# Altium schematic sheet ControlPlateGOST.SchDoc
size 420 x 297 mm; Address1: Address1; Address2: Address2; Address3: Address3; Address4: Address4; SheetNumber: 2; SheetTotal: 2; Scale: 1:1; Разраб.: Калашников Д.; Обозначение документа: КР17530324КДА10.00.00ЭЗ; Пров.: Яцун А.С.; Наименование организации: ЮЗГУ гр. МТ11-б; Перв. применение: АБВГ.123456.000; Наименование изделия 1: Блок управления; Наименование изделия 2: Схема электрическая; Наименование изделия 3: принципиальная; Нач. отд.: Нач. отд.
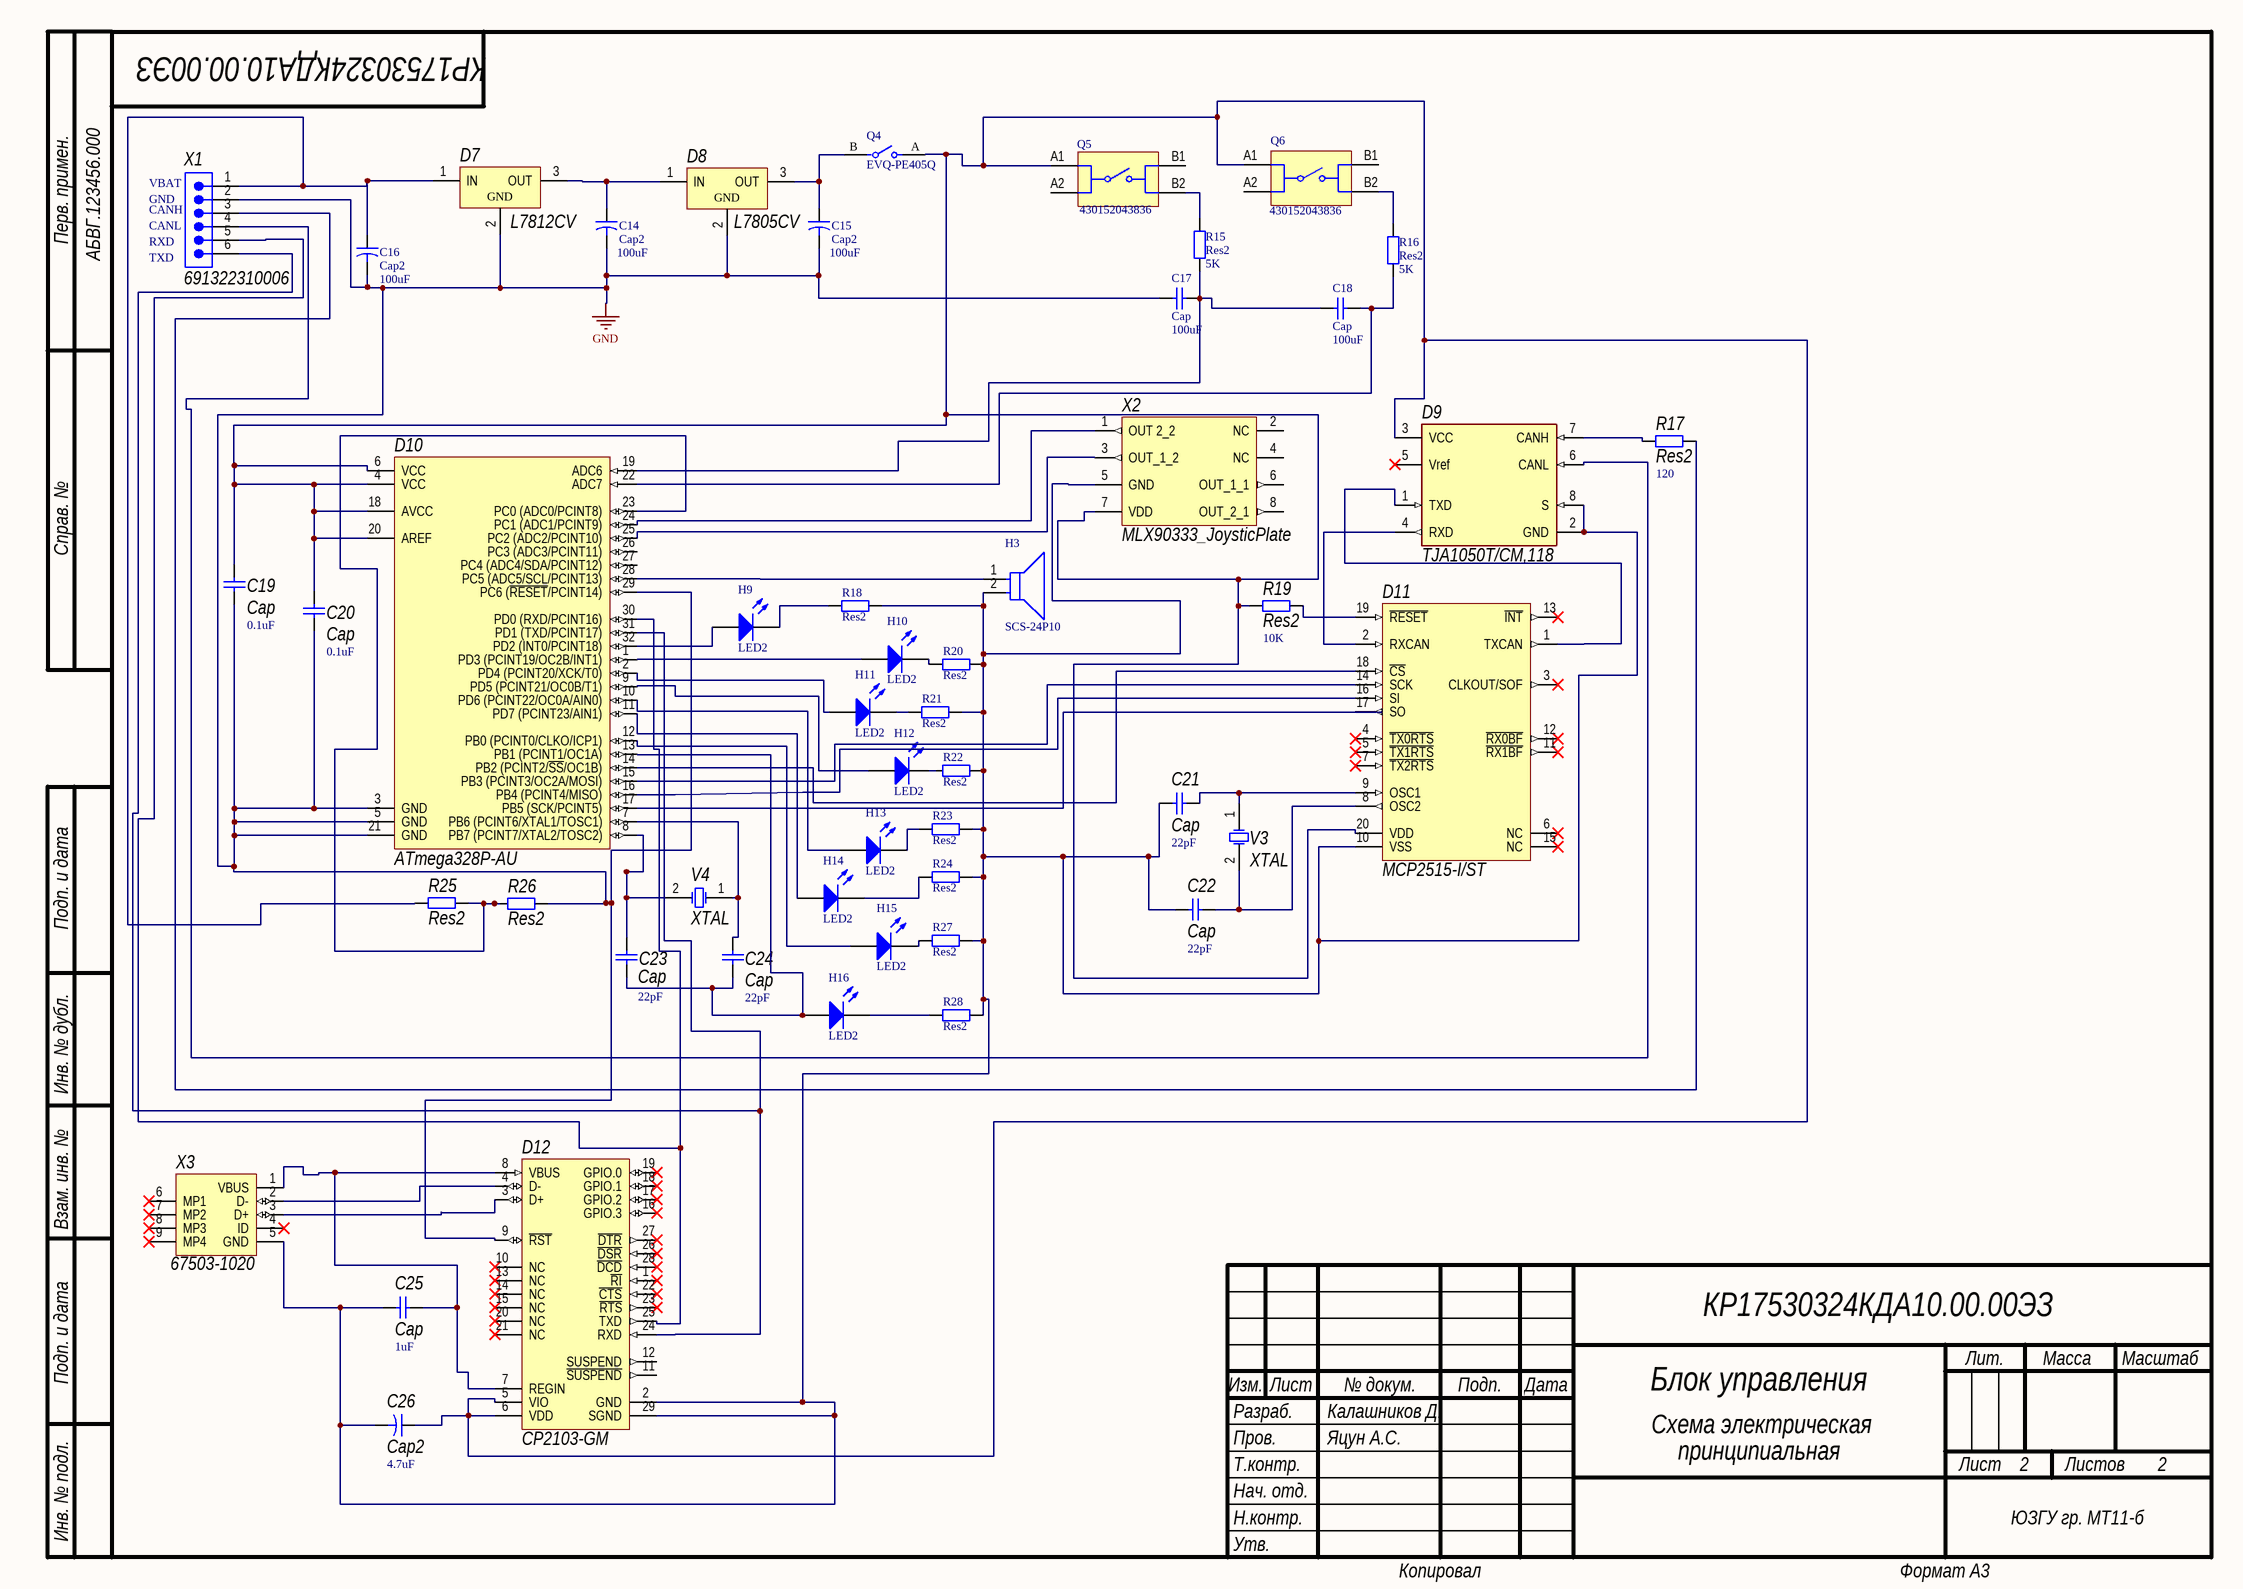
[diagram p0: ControlPlateGOST.SchDoc]

## Parts
C14  Cap2  value 100uF  [CAPR5-4X5]
C15  Cap2  value 100uF  [CAPR5-4X5]
C16  Cap2  value 100uF  [CAPR5-4X5]
C17  Cap  value 100uF  [RAD-0.3]
C18  Cap  value 100uF  [RAD-0.3]
C19  Cap  value 0.1uF  [RAD-0.3]
C20  Cap  value 0.1uF  [RAD-0.3]
C21  Cap  value 22pF  [RAD-0.3]
C22  Cap  value 22pF  [RAD-0.3]
C23  Cap  value 22pF  [RAD-0.3]
C24  Cap  value 22pF  [RAD-0.3]
C25  Cap  value 1uF  [RAD-0.3]
C26  Cap2  value 4.7uF  [CAPR5-4X5]
D7  L7812CV  [TO220]
D8  L7805CV  [TO220]
D9  TJA1050T/CM,118  [FP-SOT96-1-IPC_A]
D10  ATmega328P-AU  [32A_M]
D11  MCP2515-I/ST  [TSSOP-ST20_N]
D12  CP2103-GM  [SLAB-QFN-28-3125x3125TP_A_M]
H3  SCS-24P10  [FP-PKB24SPCH3601-B0-MFG]
H9  LED2  [3.2X1.6X1.1]
H10  LED2  [3.2X1.6X1.1]
H11  LED2  [3.2X1.6X1.1]
H12  LED2  [3.2X1.6X1.1]
H13  LED2  [3.2X1.6X1.1]
H14  LED2  [3.2X1.6X1.1]
H15  LED2  [3.2X1.6X1.1]
H16  LED2  [3.2X1.6X1.1]
Q4  EVQ-PE405Q  [FP-EVQ-PE405Q-MFG]
Q5  430152043836  [WS-TASV_L6W6H4.3_4301x20438x6]
Q6  430152043836  [WS-TASV_L6W6H4.3_4301x20438x6]
R15  Res2  value 5K  [AXIAL-0.4]
R16  Res2  value 5K  [AXIAL-0.4]
R17  Res2  value 120  [AXIAL-0.4]
R18  Res2  [AXIAL-0.4]
R19  Res2  value 10K  [AXIAL-0.4]
R20  Res2  [AXIAL-0.4]
R21  Res2  [AXIAL-0.4]
R22  Res2  [AXIAL-0.4]
R23  Res2  [AXIAL-0.4]
R24  Res2  [AXIAL-0.4]
R25  Res2  [AXIAL-0.4]
R26  Res2  [AXIAL-0.4]
R27  Res2  [AXIAL-0.4]
R28  Res2  [AXIAL-0.4]
V3  XTAL  [R38]
V4  XTAL  [R38]
X1  691322310006  [691322310006]
X2  MLX90333_JoysticPlate  [MLX90333_Joy]
X3  67503-1020  [MOLX-67503-1020_V]

## Nets
GND: C14.2 C15.2 C16.2 C17.2 C19.2 C20.2 D7.2(GND) D8.2(GND) D10.3(GND) D10.5(GND) D10.21(GND) D10.29(PC6_(~{RESET}/PCINT14)) D12.9(~{RST}) R26.2 X1.2
NetC14_1: C14.1 D7.3(OUT) D8.1(IN)
NetC15_1: C15.1 D8.3(OUT) Q4.B
NetC16_1: C16.1 D7.1(IN) R25.1 X1.1
NetC17_1: C17.1 C18.2 D10.19(ADC6) R15.2
NetC18_1: C18.1 D10.22(ADC7) R16.2
NetC19_1: C19.1 C20.1 C26.1 D9.3(VCC) D10.4(VCC) D10.6(VCC) D10.18(AVCC) D10.20(AREF) D11.20(VDD) D12.5(VIO) D12.6(VDD) Q4.A Q5.A1 Q6.A1 R19.1 X2.7(VDD)
NetC21_1: C21.1 C22.1 C25.2 C26.2 D9.2(GND) D9.8(S) D11.10(VSS) D12.2(GND) D12.29(SGND) H3.2(A) R18.1 R20.1 R21.1 R22.1 R23.1 R24.1 R27.1 R28.1 X2.5(GND) X3.5(GND)
NetC21_2: C21.2 D11.9(OSC1) V3.1(OSC1)
NetC22_2: C22.2 D11.8(OSC2) V3.2(OSC2)
NetC23_1: C23.1 C24.1 D10.13(PB1_(PCINT1/OC1A)) H16.1(A)
NetC23_2: C23.2 D10.8(PB7_(PCINT7/XTAL2/TOSC2)) V4.2(OSC2)
NetC24_2: C24.2 D10.7(PB6_(PCINT6/XTAL1/TOSC1)) V4.1(OSC1)
NetC25_1: C25.1 D12.7(REGIN) D12.8(VBUS) X3.1(VBUS)
NetD9_1: D9.1(TXD) D11.1(TXCAN)
NetD9_4: D9.4(RXD) D11.2(RXCAN)
NetD9_6: D9.6(CANL) X1.4
NetD9_7: D9.7(CANH) R17.1
NetD10_1: D10.1(PD3_(PCINT19/OC2B/INT1)) H10.1(A)
NetD10_2: D10.2(PD4_(PCINT20/XCK/T0)) H11.1(A)
NetD10_9: D10.9(PD5_(PCINT21/OC0B/T1)) H12.1(A)
NetD10_10: D10.10(PD6_(PCINT22/OC0A/AIN0)) H13.1(A)
NetD10_11: D10.11(PD7_(PCINT23/AIN1)) H14.1(A)
NetD10_12: D10.12(PB0_(PCINT0/CLKO/ICP1)) H15.1(A)
NetD10_14: D10.14(PB2_(PCINT2/~{SS}/OC1B)) D11.18(~{CS})
NetD10_15: D10.15(PB3_(PCINT3/OC2A/MOSI)) D11.14(SCK)
NetD10_16: D10.16(PB4_(PCINT4/MISO)) D11.16(SI)
NetD10_17: D10.17(PB5_(SCK/PCINT5)) D11.17(SO)
NetD10_23: D10.23(PC0_(ADC0/PCINT8)) R25.2 R26.1
NetD10_24: D10.24(PC1_(ADC1/PCINT9)) X2.1(OUT_2_2)
NetD10_25: D10.25(PC2_(ADC2/PCINT10)) X2.3(OUT_1_2)
NetD10_28: D10.28(PC5_(ADC5/SCL/PCINT13)) H3.1(C)
NetD10_30: D10.30(PD0_(RXD/PCINT16)) D12.25(TXD) X1.5
NetD10_31: D10.31(PD1_(TXD/PCINT17)) D12.24(RXD) X1.6
NetD10_32: D10.32(PD2_(INT0/PCINT18)) H9.1(A)
NetD11_19: D11.19(~{RESET}) R19.2
NetD12_3: D12.3(D+) X3.3(D+)
NetD12_4: D12.4(D-) X3.2(D-)
NetH9_2: H9.2(K) R18.2
NetH10_2: H10.2(K) R20.2
NetH11_2: H11.2(K) R21.2
NetH12_2: H12.2(K) R22.2
NetH13_2: H13.2(K) R23.2
NetH14_2: H14.2(K) R24.2
NetH15_2: H15.2(K) R27.2
NetH16_2: H16.2(K) R28.2
NetQ5_B2: Q5.B2 R15.1
NetQ6_B2: Q6.B2 R16.1
NetR17_2: R17.2 X1.3

Not connected (* = marked no-connect by the designer): D9 5(Vref)*; D10 26(PC3_(ADC3/PCINT11)) 27(PC4_(ADC4/SDA/PCINT12)); D11 3(CLKOUT/SOF)* 4(~{TX0RTS})* 5(~{TX1RTS})* 6(NC)* 7(~{TX2RTS})* 11(~{RX1BF})* 12(~{RX0BF})* 13(~{INT})* 15(NC)*; D12 1(~{RI})* 10(NC)* 11(~{SUSPEND}) 12(SUSPEND) 13(NC)* 14(NC)* 15(NC)* 16(GPIO.3)* 17(GPIO.2)* 18(GPIO.1)* 19(GPIO.0)* 20(NC)* 21(NC)* 22(~{CTS})* 23(~{RTS})* 26(~{DSR})* 27(~{DTR})* 28(~{DCD})*; Q5 A2 B1; Q6 A2 B1; X2 2(NC) 4(NC) 6(OUT_1_1) 8(OUT_2_1); X3 4(ID)* 6(MP1)* 7(MP2)* 8(MP3)* 9(MP4)*

## Notes on the sheet
- (near X1) VBAT
- (near X1) GND
- (near X1) CANH
- (near X1) CANL
- (near X1) RXD
- (near X1) TXD
- Перв. примен.
- Справ. №
- Подп. и дата
- Инв. № дубл.
- Взам. инв. №
- Разраб.
- Изм.
- Лист
- № докум.
- Подп.
- Дата
- Лит.
- Масса
- Масштаб
- Пров.
- Т.контр.
- Листов
- Инв. № подл.
- Утв.
- Н.контр.
- Копировал
- Формат А3

## Library data of the parts
C14-C16 C26 = Cap2: Capacitor; Published: 23-Sep-2002; PackageReference: CAPR5-4X5; Publisher: Altium Limited; PackageDescription: Capacitor; 2 Leads
C17-C25 = Cap: Capacitor; Published: 8-Jun-2000; LatestRevisionDate: 17-Jul-2002; LatestRevisionNote: Re-released for DXP Platform.; PackageReference: RAD-0.3; Publisher: Altium Limited; PackageDescription: Radial Cap, Thru-Hole; 2 Leads; 0.3 in Pin Spacing
D7 = CMP-0244-00450-1: Positive Voltage Regulator, 12V, 3-Pin TO-220; PackageDescription: TO, Thru-Hole, Vertical, Heatsink Mounted; 3 In-Line Leads; Pitch 2.54 mm; ComponentLink3URL: http://www.st.com/internet/com/TECHNICAL_RESOURCES/TECHNICAL_LITERATURE/PACKAGE_INFORMATION/CD00004649.pdf; ComponentLink1URL: http://www.st.com; ComponentLink2Description: Datasheet; ComponentLink3Description: Package Specification; ComponentLink2URL: http://www.st.com/internet/com/TECHNICAL_RESOURCES/TECHNICAL_LITERATURE/DATASHEET/CD00000444.pdf; DatasheetVersion: 16/11/2011; PackageVersion: ver3.0; PackageReference: TO220; ComponentLink1Description: Manufacturer URL
D8 = CMP-0244-00483-1: Positive Voltage Regulator, 5V, 3-Pin TO-220; PackageDescription: TO, Thru-Hole, Vertical, Heatsink Mounted; 3 In-Line Leads; Pitch 2.54 mm; ComponentLink2Description: Datasheet; PackageReference: TO220; ComponentLink3URL: http://www.st.com/internet/com/TECHNICAL_RESOURCES/TECHNICAL_LITERATURE/PACKAGE_INFORMATION/CD00004649.pdf; DatasheetVersion: 16/11/2011; ComponentLink1Description: Manufacturer URL; ComponentLink1URL: http://www.st.com; PackageVersion: ver3.0; ComponentLink3Description: Package Specification; ComponentLink2URL: http://www.st.com/internet/com/TECHNICAL_RESOURCES/TECHNICAL_LITERATURE/DATASHEET/CD00000444.pdf
D9 = CMP-2000-04923-2: IC TRANSCEIVER HALF 1/1 8SO; Simplex/Duplex: Half Duplex; Max Supply Current: 10mA; Number of Receive Buffers: 1; Min Supply Voltage: 4.75V; Max Supply Voltage: 5.25V; Interface: CAN; Data Rate: 1Mbps; Receiver Hysteresis: 70mV; Number of Transmit Buffers: 1; Min Operating Temperature: -40°C; Case/Package: SO; REACH SVHC: No SVHC; Max Operating Temperature: 150°C; Number of Pins: 8; Lead Free: Lead Free; Number of Transceivers: 1; Packaging: Tape and Reel; Mount: Surface Mount; Radiation Hardening: No; Nominal Supply Current: 10mA; Package Quantity: 2500; Contact Plating: Gold
D10 = CMP-0095-00269-2: 8-bit AVR Microcontroller, 32KB Flash, 1KB EEPROM, 2KB SRAM, 32-pin TQFP, Industrial Grade (-40°C to 85°C); PackageDescription: 32-Lead, 7x7x1.0 mm Body, 0.8mm Lead Pitch, Thin Profile Plastic Quad Flat Package (TQFP); DatasheetVersion: revD, May-2011; RevisionNote: DatasheetVersion & PackageVersion updated. URLs added.; ComponentLink1URL: http://www.atmel.com/; ComponentLink2Description: ATmega48A/48PA/88A/88PA/168A/168PA/328/328P Datasheet; Code_JEDEC: MS-026-ABA; ComponentLink1Description: Manufacturer URL; PackageReference: 32A; ComponentLink3Description: ATmega48A/48PA/88A/88PA/168A/168PA/328/328P Summary; ComponentLink2URL: http://www.atmel.com/dyn/resources/prod_documents/doc8271.pdf; PackageVersion: revC, Oct-2010; ComponentLink3URL: http://www.atmel.com/dyn/resources/prod_documents/8271S.pdf
D11 = CMP-0186-00077-2: Stand-Alone CAN Controller With SPI Interface, 20-Pin TSSOP, Industrial Temperature; DatasheetVersion: revF, Oct-2010; ComponentLink1Description: Manufacturer URL; PackageDescription: 20-Lead Plastic Thin Shrink Small Outline (ST) - 4.4mm Body [TSSOP]; ComponentLink1URL: http://www.microchip.com/; RevisionNote: URLs added. DatasheetVersion updated.; PackageReference: TSSOP-ST20; Code_JEDEC: MO-153-AC; ComponentLink2Description: Datasheet; ComponentLink2URL: http://ww1.microchip.com/downloads/en/DeviceDoc/21801f.pdf; PackageVersion: revBB, Aug-2009; ComponentLink3URL: http://www.microchip.com/stellent/groups/techpub_sg/documents/packagingspec/en012702.pdf; ComponentLink3Description: Package Specification
D12 = CMP-0511-00006-1: Single-Chip USB to UART Bridge, 1024 Bytes EEPROM, -40 to 85 degC, 28-pin QFN, Tube; Manufacturer: Silicon Labs; Internal Oscillator: TRUE; Sub-Family: USB Bridges; PackageDescription: 28-Pin Quad-Flat No-Leads Package, Body 5 x 5 mm, Pitch 0.5 mm; PartNumber: CP2103-GM; ComponentLink2Description: Datasheet; ComponentLink2URL: http://www.silabs.com/Support%20Documents/TechnicalDocs/CP2103.pdf; ComponentLink1URL: http://www.silabs.com/; Mounting Technology: Surface Mount; ComponentLink1Description: Manufacturer URL; PackageReference: QFN-28; EEPROM: 1024 Bytes; DatasheetVersion: Rev. 1.0; ComponentLink3Description: Package Specification; ComponentLink3URL: http://www.silabs.com/Support%20Documents/TechnicalDocs/C8051F35x.pdf
H3 = CMP-06203-000001-2: AUDIO PIEZO TRANSDUCER 3-15V TH; Self Resonant Frequency: 3.6kHz; Voltage Rating (DC): 15V; Min Supply Voltage: 3V; Operating Supply Current: 16mA; Voltage Rating: 12V; Max Frequency: 4.1kHz; Washable: No; REACH SVHC: No SVHC; Packaging: Bulk; Frequency: 3.6kHz; Max Operating Temperature: 70°C; Max Supply Voltage: 15V; Max Supply Voltage (DC): 15V; Diameter: 24.3mm; Lead Free: Lead Free; Radiation Hardening: No; Nominal Supply Current: 16mA; Height: 9.7mm; Mount: Flush; Nominal Supply Voltage (DC): 12V; Min Operating Temperature: -20°C; Termination: PC Pins; Length: 24.3mm; Package Quantity: 650; Min Supply Voltage (DC): 3V; Max Supply Current: 16mA
H9-H16 = LED2: Typical RED, GREEN, YELLOW, AMBER GaAs LED; Published: 8-Jun-2000; LatestRevisionDate: 17-Jul-2002; LatestRevisionNote: Re-released for DXP Platform.; PackageVersion: Feb-2002; PackageReference: 3.2X1.6X1.1; Publisher: Altium Limited; PackageDescription: SM LED; 2 Flat Leads
Q4 = CMP-05618-000107-1: SWITCH TACTILE SPST-NO 0.05A 12V; Mechanical Life: 50000Cycles; Actuator Type: Standard; Actuator Color: Grey; Contact Current Rating: 50mA; Switch Function: Off-Mom; Switch Travel: 0.25mm; Actuator Length: 1.5mm; Operating Force: 1N; Illumination Type: Non-Illuminated; Throw Configuration: SPST; Contact Resistance: 100mR; Mount: Through Hole; Contact Plating: Silver; Max Operating Temperature: 85°C; Max Voltage Rating (DC): 12V; Electrical Life: 50000Cycles; Current Rating: 50mA; Series: EVQPE; Length: 6mm; Size: 3.5mm; Packaging: Bulk; Termination: PC Pin; Min Operating Temperature: -30°C; Lead Free: Lead Free; Height: 5mm; Voltage Rating (DC): 12V; REACH SVHC: No SVHC; Width: 3.5mm; Package Quantity: 1000; Depth: 7.9mm; Max Current Rating: 50mA; Orientation: Straight
Q5 Q6 = CMP-1452-00002-2: NexarPartId: 22861785; Voltage Rating: 12V; Current Rating: 50mA; Switch Travel: 250µm; Switch Function: Off-Mom; Color: Orange; Actuator Material: Liquid Crystal Polymer, Polymer; Insulation Resistance: 100MΩ; Actuator Length: 900µm; Throw Configuration: SPST; Mechanical Life: 200kcycles; Illumination Type: Illuminated, Non-Illuminated; Mount: Surface Mount; Max Operating Temperature: 85°C; Height: 4.3mm; RoHS: Compliant; Length: 6.2mm; Width: 6.2mm; Contact Current Rating: 50mA; Diameter: 3.5mm; Termination: Gull Wing; Packaging: Tape and Reel; REACH SVHC: No SVHC; Contact Plating: Silver; Min Operating Temperature: -40°C; Contact Material: Stainless Steel, Steel
R15-R17 R19 = Res2: Resistor; Published: 8-Jun-2000; LatestRevisionDate: 17-Jul-2002; LatestRevisionNote: Re-released for DXP Platform.; PackageReference: AXIAL-0.4; Publisher: Altium Limited; PackageDescription: Axial Device, Thru-Hole; 2 Leads; 0.4 in Pin Spacing
R18 R20-R24 R27 R28 = Res2: Resistor; Value: 220; Published: 8-Jun-2000; LatestRevisionDate: 17-Jul-2002; LatestRevisionNote: Re-released for DXP Platform.; PackageReference: AXIAL-0.4; Publisher: Altium Limited; PackageDescription: Axial Device, Thru-Hole; 2 Leads; 0.4 in Pin Spacing
R25 = Res2: Resistor; Value: 2.4K; Published: 8-Jun-2000; LatestRevisionDate: 17-Jul-2002; LatestRevisionNote: Re-released for DXP Platform.; PackageReference: AXIAL-0.4; Publisher: Altium Limited; PackageDescription: Axial Device, Thru-Hole; 2 Leads; 0.4 in Pin Spacing
R26 = Res2: Resistor; Value: 500; Published: 8-Jun-2000; LatestRevisionDate: 17-Jul-2002; LatestRevisionNote: Re-released for DXP Platform.; PackageReference: AXIAL-0.4; Publisher: Altium Limited; PackageDescription: Axial Device, Thru-Hole; 2 Leads; 0.4 in Pin Spacing
V3 V4 = XTAL: Crystal Oscillator; Published: 8-Jun-2000; LatestRevisionDate: 17-Jul-2002; LatestRevisionNote: Re-released for DXP Platform.; PackageReference: R38; Publisher: Altium Limited; PackageDescription: Crystal, Thru-Hole; 2 Leads; Body 3.1 x 8.2 mm (Dia.xH)
X1 = CMP-1502-01890-2: NexarPartId: 8917781; Number of Contacts: 6; Number of Levels: 1; Voltage: 300V; Current: 10A; Gender: Male; Pitch: 3.81mm; Width: 24.25mm; Length: 10.5mm; Number of Pins: 6; Contact Material: Brass; Number of Rows: 1; Lead Pitch: 3.81mm; REACH SVHC: No SVHC; Color: Green; RoHS: Compliant; Number of Positions Per Level: 6; Height: 9.2mm; Packaging: Box; Termination: Solder; Mount: Through Hole; Contact Plating: Tin
X3 = CMP-0411-00002-1: USB, MINI, SMD, RA KME04-USBMU03A01; Manufacturer: Molex; ComponentLink1URL: http://www.molex.com/; PartNumber: 67503-1020; Mounting Technology: Surface Mount; ComponentLink1Description: Manufacturer URL; Terminal Pitch: 0.8 mm; DatasheetVersion: Rev F, 06/2009; ComponentLink2Description: Datasheet; PackageDescription: Mini USB Connector, SMT, Righer Angle; ComponentLink2URL: http://www.molex.com/pdm_docs/sd/675031020_sd.pdf; PackageReference: 67503-1020